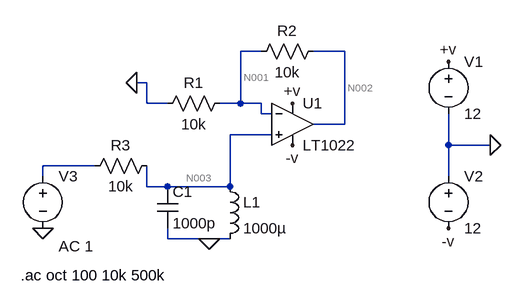
[diagram p0: schematic Draft28.asc]
Draft28.asc, the LTspice schematic file:
Version 4
SHEET 1 880 680
WIRE 224 16 192 16
WIRE 352 16 304 16
WIRE 48 64 32 64
WIRE 48 96 48 64
WIRE 80 96 48 96
WIRE 192 96 192 16
WIRE 192 96 160 96
WIRE 224 96 192 96
WIRE 224 112 224 96
WIRE 240 112 224 112
WIRE 352 128 352 16
WIRE 352 128 304 128
WIRE 240 144 176 144
WIRE 512 160 512 112
WIRE 576 160 512 160
WIRE -32 192 -112 192
WIRE -112 208 -112 192
WIRE 512 208 512 160
WIRE 48 224 48 192
WIRE 80 224 48 224
WIRE 176 224 176 144
WIRE 176 224 80 224
WIRE 80 304 80 288
WIRE 144 304 80 304
WIRE 176 304 144 304
FLAG 32 64 0
FLAG 144 304 0
FLAG -112 288 0
FLAG 576 160 0
FLAG 272 96 +v
FLAG 512 32 +v
FLAG 272 160 -v
FLAG 512 288 -v
SYMBOL voltage 512 16 R0
SYMATTR InstName V1
SYMATTR Value 12
SYMBOL voltage 512 192 R0
SYMATTR InstName V2
SYMATTR Value 12
SYMBOL voltage -112 192 R0
WINDOW 123 24 124 Left 2
WINDOW 39 0 0 Left 0
SYMATTR InstName V3
SYMATTR Value ""
SYMATTR Value2 AC 1
SYMBOL Opamps\\LT1022 272 64 R0
SYMATTR InstName U1
SYMBOL cap 64 224 R0
SYMATTR InstName C1
SYMATTR Value 1000p
SYMBOL ind 160 208 R0
SYMATTR InstName L1
SYMATTR Value 1000µ
SYMBOL res 176 80 R90
WINDOW 0 0 56 VBottom 2
WINDOW 3 32 56 VTop 2
SYMATTR InstName R1
SYMATTR Value 10k
SYMBOL res 320 0 R90
WINDOW 0 0 56 VBottom 2
WINDOW 3 32 56 VTop 2
SYMATTR InstName R2
SYMATTR Value 10k
SYMBOL res 64 176 R90
WINDOW 0 0 56 VBottom 2
WINDOW 3 32 56 VTop 2
SYMATTR InstName R3
SYMATTR Value 10k
TEXT -146 360 Left 2 !.ac oct 100 10k 500k

The netlist it stands for:
* Draft28.asc
V1 +v 0 12
V2 0 -v 12
V3 N004 0 AC 1
XU1 N003 N001 +v -v N002 LT1022  ; pins In+ In- V+ V- OUT
C1 N003 0 1000p
L1 N003 0 1000µ
R1 N001 0 10k
R2 N002 N001 10k
R3 N003 N004 10k
.ac oct 100 10k 500k
.backanno
.end

* Results of the author's LTspice run, read from the files saved beside the schematic
* Operating Point, zero values left out:
*   V(+v) = 12 V
*   V(-v) = -12 V
*   I(V2) = -5.2 mA
*   I(V1) = -5.2 mA
*   Ix(u1:3) = 5.2 mA
*   Ix(u1:4) = -5.2 mA
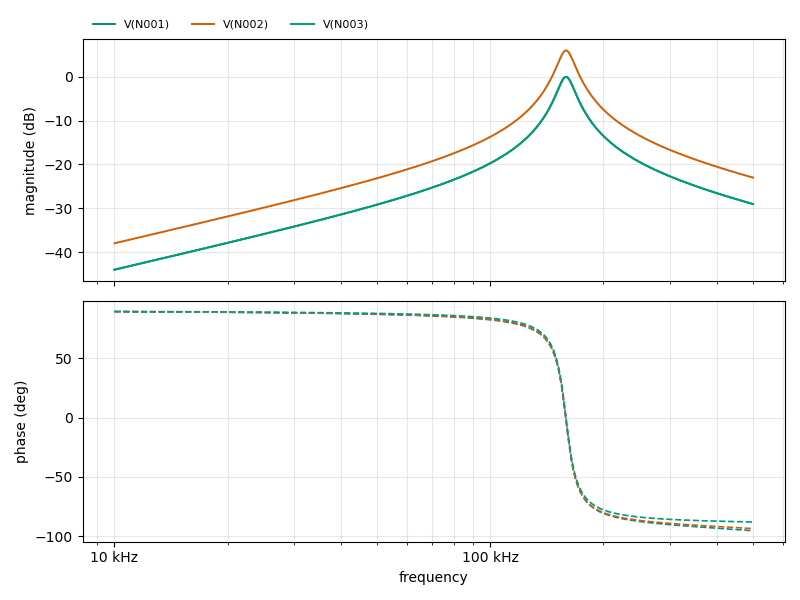
[diagram p1: AC Analysis of Draft28.asc, plotted from the saved traces]
* AC Analysis, 1 run:
*   V(N001): -44.00 dB at 10 kHz, -29.03 dB at 500 kHz, peak 0.00 dB at 158.9 kHz, 3 dB below the peak at 151.3 kHz and 167.1 kHz
*   V(N002): -37.98 dB at 10 kHz, -23.00 dB at 500 kHz, peak 6.02 dB at 158.9 kHz, 3 dB below the peak at 151.3 kHz and 167.1 kHz
*   V(N003): -44.00 dB at 10 kHz, -29.04 dB at 500 kHz, peak -0.00 dB at 158.9 kHz, 3 dB below the peak at 151.3 kHz and 167.1 kHz